# Altium schematic sheet Block Diagram.SchDoc
size Tabloid
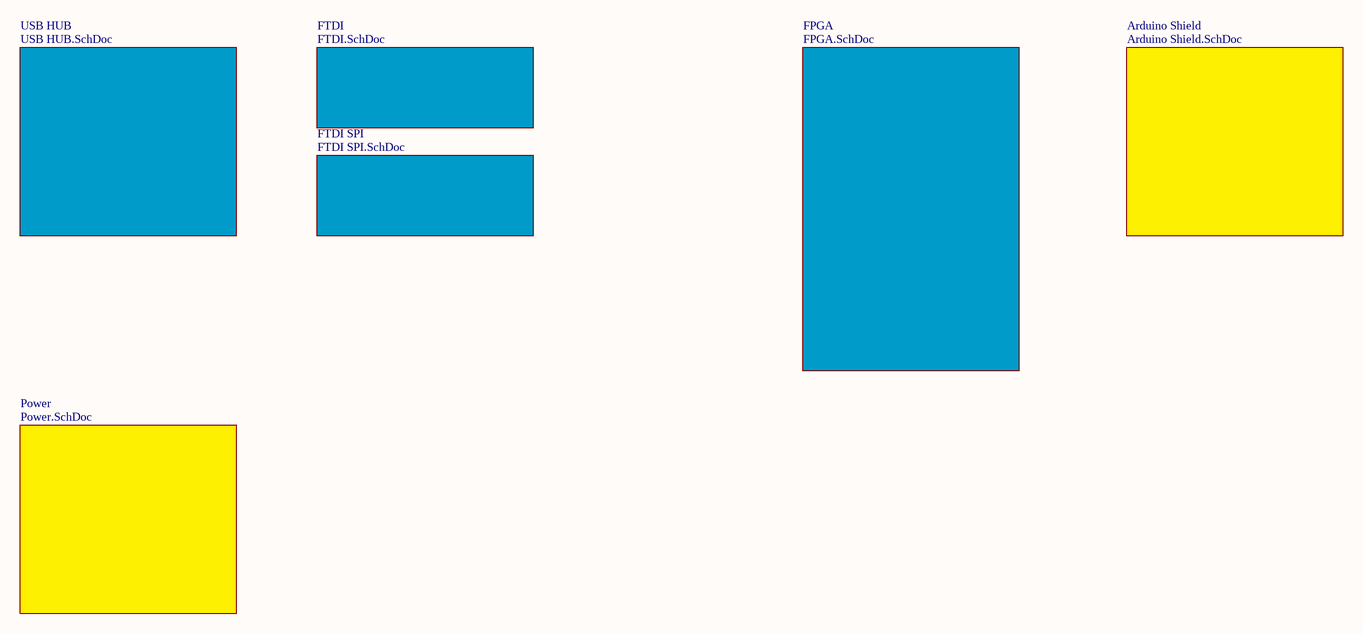
[diagram p0: Block Diagram.SchDoc]

## Sub-sheets
Arduino Shield = Arduino Shield.SchDoc: no entries
FPGA = FPGA.SchDoc: no entries
FTDI = FTDI.SchDoc: no entries
FTDI SPI = FTDI SPI.SchDoc: no entries
Power = Power.SchDoc: no entries
USB HUB = USB HUB.SchDoc: no entries

## Notes on the sheet
- Title:
- http://www.cospandesign.com
- Cospan Design
- Project:
- Document:
- Engineer:
- Revision:
- Drawn By:
- Date:
- Number:
- of